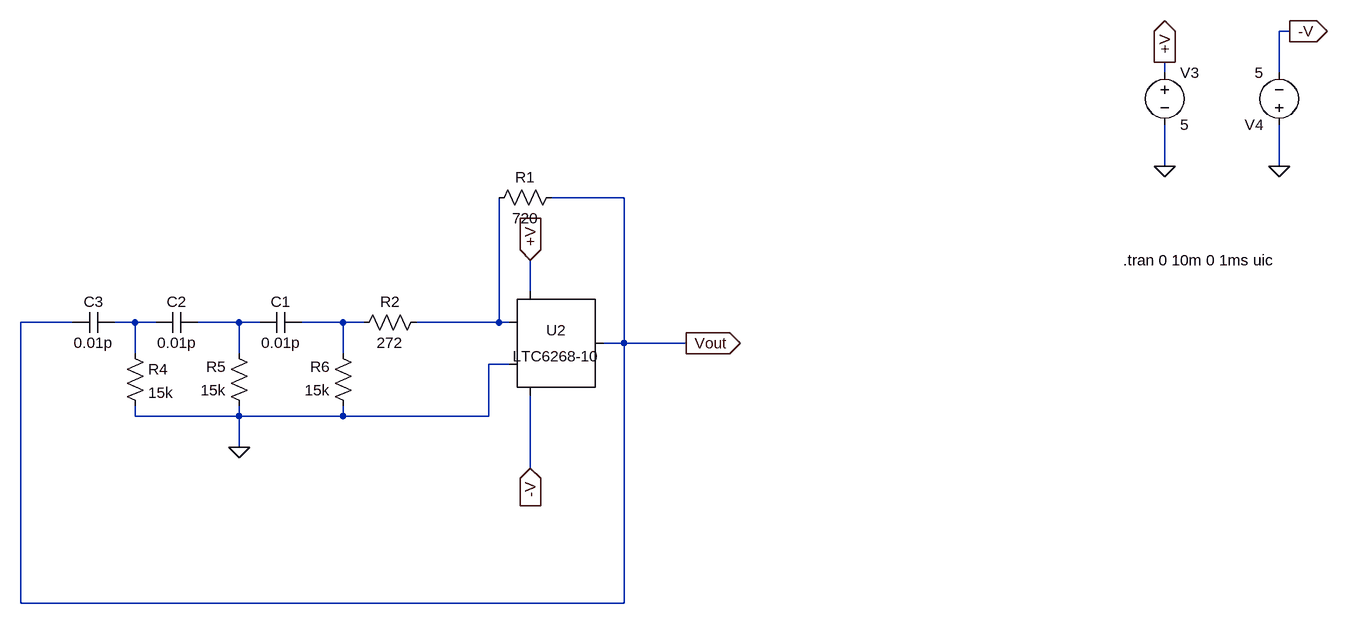
[diagram p0: schematic Kelompok_19_schematic_ltspice.asc]
Kelompok_19_schematic_ltspice.asc, the LTspice schematic file:
Version 4
SHEET 1 2000 700
WIRE 1856 -1600 1840 -1600
WIRE 1664 -1536 1664 -1552
WIRE 1840 -1536 1840 -1600
WIRE 1664 -1392 1664 -1456
WIRE 1840 -1392 1840 -1456
WIRE 832 -1344 720 -1344
WIRE 688 -1200 688 -1248
WIRE -16 -1152 -96 -1152
WIRE 80 -1152 48 -1152
WIRE 112 -1152 80 -1152
WIRE 240 -1152 176 -1152
WIRE 272 -1152 240 -1152
WIRE 400 -1152 336 -1152
WIRE 432 -1152 400 -1152
WIRE 640 -1152 640 -1344
WIRE 640 -1152 512 -1152
WIRE 656 -1152 640 -1152
WIRE 832 -1120 832 -1344
WIRE 832 -1120 800 -1120
WIRE 928 -1120 832 -1120
WIRE 80 -1104 80 -1152
WIRE 240 -1104 240 -1152
WIRE 400 -1104 400 -1152
WIRE 656 -1088 624 -1088
WIRE 80 -1008 80 -1024
WIRE 240 -1008 240 -1024
WIRE 240 -1008 80 -1008
WIRE 400 -1008 400 -1024
WIRE 400 -1008 240 -1008
WIRE 624 -1008 624 -1088
WIRE 624 -1008 400 -1008
WIRE 240 -960 240 -1008
WIRE 688 -928 688 -1040
WIRE -96 -720 -96 -1152
WIRE 832 -720 832 -1120
WIRE 832 -720 -96 -720
FLAG 1664 -1552 +V
IOPIN 1664 -1552 Out
FLAG 1856 -1600 -V
IOPIN 1856 -1600 Out
FLAG 1664 -1392 0
FLAG 1840 -1392 0
FLAG 240 -960 0
FLAG 688 -1248 +V
IOPIN 688 -1248 In
FLAG 928 -1120 Vout
IOPIN 928 -1120 Out
FLAG 688 -928 -V
IOPIN 688 -928 In
SYMBOL voltage 1664 -1552 R0
WINDOW 123 0 0 Left 2
WINDOW 39 0 0 Left 2
SYMATTR InstName V3
SYMATTR Value 5
SYMBOL voltage 1840 -1440 R180
WINDOW 123 24 146 Left 2
WINDOW 39 24 125 Left 2
SYMATTR InstName V4
SYMATTR Value 5
SYMBOL res 736 -1360 R90
WINDOW 0 0 56 VBottom 2
WINDOW 3 32 56 VTop 2
SYMATTR InstName R1
SYMATTR Value 720
SYMBOL cap -16 -1136 R270
WINDOW 0 32 32 VTop 2
WINDOW 3 0 32 VBottom 2
SYMATTR InstName C3
SYMATTR Value 0.01p
SYMBOL res 64 -1120 R0
SYMATTR InstName R4
SYMATTR Value 15k
SYMBOL res 256 -1008 R180
WINDOW 0 36 76 Left 2
WINDOW 3 36 40 Left 2
SYMATTR InstName R5
SYMATTR Value 15k
SYMBOL cap 272 -1136 R270
WINDOW 0 32 32 VTop 2
WINDOW 3 0 32 VBottom 2
SYMATTR InstName C1
SYMATTR Value 0.01p
SYMBOL cap 112 -1136 R270
WINDOW 0 32 32 VTop 2
WINDOW 3 0 32 VBottom 2
SYMATTR InstName C2
SYMATTR Value 0.01p
SYMBOL res 416 -1008 R180
WINDOW 0 36 76 Left 2
WINDOW 3 36 40 Left 2
SYMATTR InstName R6
SYMATTR Value 15k
SYMBOL OpAmps\\LTC6268-10 688 -1120 R0
SYMATTR InstName U2
SYMBOL res 528 -1168 R90
WINDOW 0 0 56 VBottom 2
WINDOW 3 32 56 VTop 2
SYMATTR InstName R2
SYMATTR Value 272
TEXT 1600 -1248 Left 2 !.tran 0 10m 0 1ms uic

The netlist it stands for:
* Kelompok_19_schematic_ltspice.asc
V3 +V 0 5
V4 0 -V 5
R1 Vout N004 720
C3 Vout N001 0.01p
R4 N001 0 15k
R5 0 N002 15k
C1 N002 N003 0.01p
C2 N001 N002 0.01p
R6 0 N003 15k
XU2 0 N004 Vout +V -V NC_01 LTC6268-10
R2 N004 N003 272
.tran 0 10m 0 1ms uic
.lib LTC2.lib
.backanno
.end